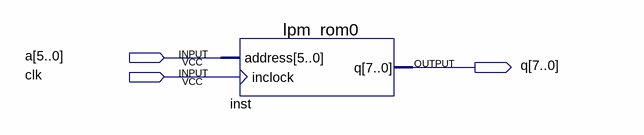
[diagram p0: schematic sheet]
// Quartus schematic lab1_rom.bdf as structural Verilog: 1 symbols, 3 pins
module lab1_rom (
  input  [5:0] a,
  input  clk,
  output [7:0] q
);

  lpm_rom0 inst (.address(a), .inclock(clk), .q(q));
endmodule
